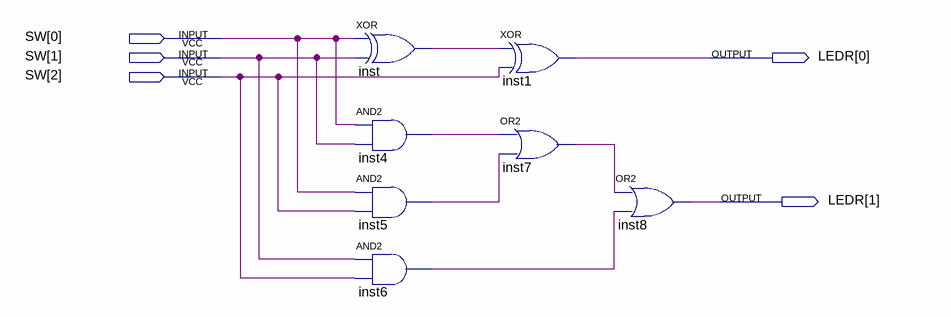
[diagram p0: schematic sheet]
// Quartus schematic SingleAdder.bdf as structural Verilog: 7 symbols, 5 pins
module SingleAdder (
  input  [2:0] SW,
  output [1:0] LEDR
);

  wire inst4_out, inst5_out, inst6_out, inst7_out, inst_out;

  xor inst (inst_out, SW[0], SW[1]);
  and inst4 (inst4_out, SW[0], SW[1]);
  and inst5 (inst5_out, SW[0], SW[2]);
  and inst6 (inst6_out, SW[1], SW[2]);
  xor inst1 (LEDR[0], inst_out, SW[2]);
  or inst7 (inst7_out, inst4_out, inst5_out);
  or inst8 (LEDR[1], inst7_out, inst6_out);
endmodule
